# EAGLE design dip16breakout (EAGLE 8.6.0)
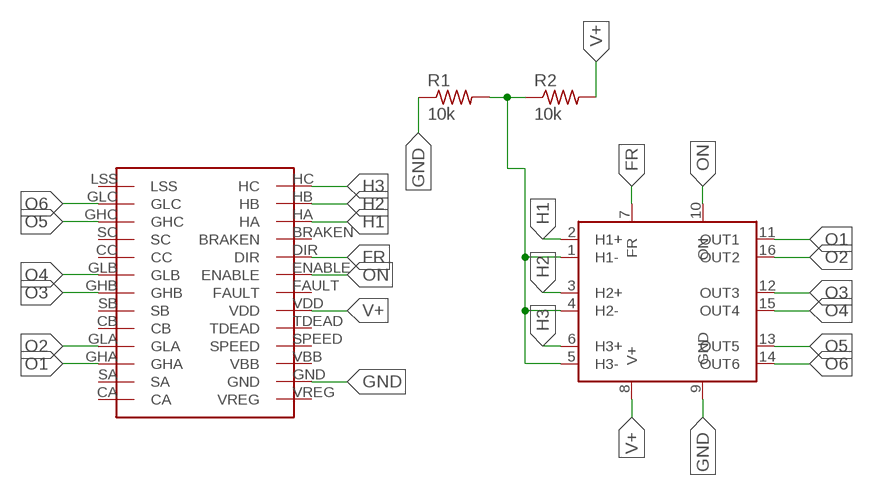
[diagram p0: schematic, sheet 1]

## Parts
R1  10k  R-US_R0805  [R0805]
R2  10k  R-US_R0805  [R0805]
U$1  NJM2624A  [DMP16]
U$2  TSSOP28-BRK  [TSSOP28-BRK]

## Nets
FR: U$1.7(FR) U$2.DIR
GND: R1.1 U$1.9(GND) U$2.GND
H1: U$1.2(H1+) U$2.HA
H2: U$1.3(H2+) U$2.HB
H3: U$1.6(H3+) U$2.HC
N$1: R1.2 R2.1 U$1.1(H1-) U$1.4(H2-) U$1.5(H3-)
O1: U$1.11(OUT1) U$2.GHA
O2: U$1.16(OUT2) U$2.GLA
O3: U$1.12(OUT3) U$2.GHB
O4: U$1.15(OUT4) U$2.GLB
O5: U$1.13(OUT5) U$2.GHC
O6: U$1.14(OUT6) U$2.GLC
ON: U$1.10(ON) U$2.ENABLE
V+: R2.2 U$1.8(V+) U$2.VDD
Unconnected: U$2.BRAKEN U$2.CA U$2.CB U$2.CC U$2.FAULT U$2.LSS U$2.SA U$2.SB U$2.SC U$2.SPEED U$2.TDEAD U$2.VBB U$2.VREG

## Library data of the parts
R1 R2 = resistor:R-US_: RESISTOR, American symbol
U$1 = NJM2624A:NJM2624A
U$2 = dedo:TSSOP28-BRK

## Board
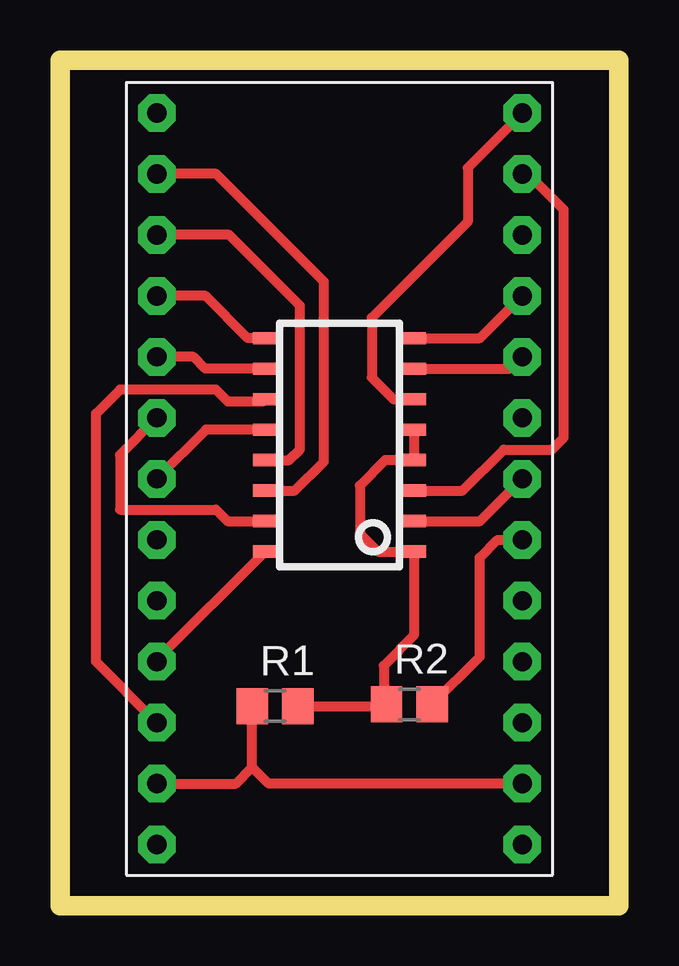
[diagram p1: board, top side]
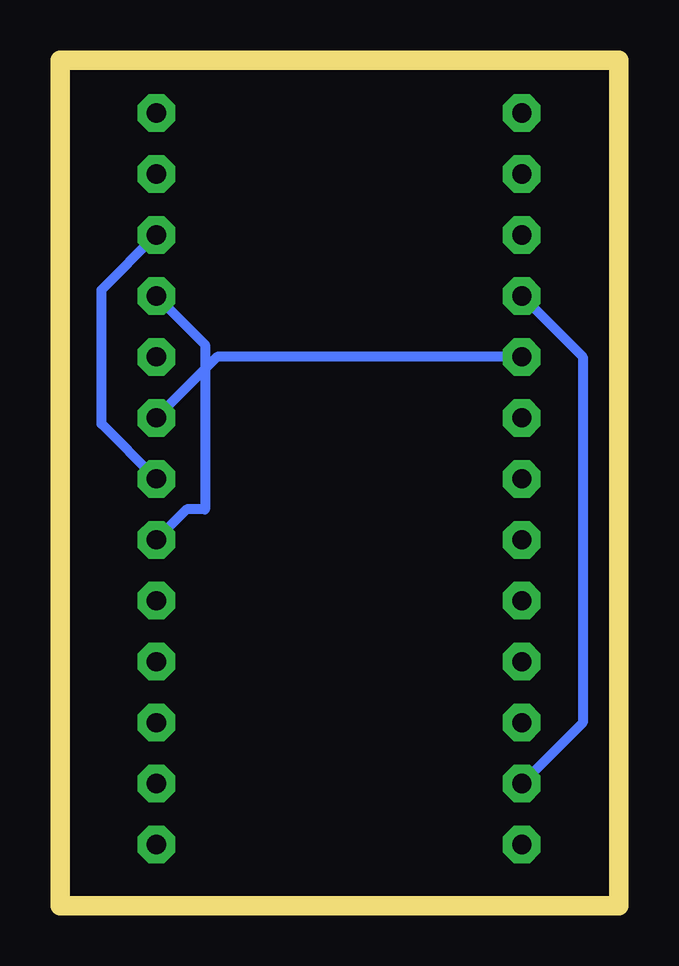
[diagram p2: board, bottom side, seen from below]

Size 23.3 x 35.23 mm. Coordinates in mm from the lower left corner, seen from the top.
Outline: 0,0 23.3,0 23.3,35.23 0,35.23 0,0
Copper layers (1*16): Top 0.035mm / dielectric 1.5mm / Bottom 0.035mm
Design rules "default *": minimum track width 6mil, minimum drill 0.35mm, track to track 6mil, track to pad 6mil, pad to pad 6mil, via to via 6mil, smd to smd 6mil, copper to edge 40mil, drill to drill 6mil, minimum pad ring 15mil, minimum via ring 8mil, stop-mask expansion 4mil, vias tented up to drill 0mil, thermal gap 10mil

### Footprints (pad centres in the part's own frame; a part is rotated, then mirrored left to right if it is on the bottom)
R0805 = smd 1.3 x 1.5: 1 -0.95,0; 2 0.95,0
DMP16 = smd 0.508 x 1.016: 1 -4.3,-3.1; 2 -3.03,-3.1; 3 -1.76,-3.1; 4 -0.49,-3.1; 5 0.78,-3.1; 6 2.05,-3.1; 7 3.32,-3.1; 8 4.59,-3.1; 9 4.59,3.1; 10 3.32,3.1; 11 2.05,3.1; 12 0.78,3.1; 13 -0.49,3.1; 14 -1.76,3.1; 15 -3.03,3.1; 16 -4.3,3.1
TSSOP28-BRK = drill 0.8 octagon: BRAKEN 7.62,8.89; CA -7.62,-13.97; CB -7.62,-3.81; CC -7.62,6.35; DIR 7.62,6.35; ENABLE 7.62,3.81; FAULT 7.62,1.27; GHA -7.62,-8.89; GHB -7.62,1.27; GHC -7.62,11.43; GLA -7.62,-6.35; GLB -7.62,3.81; GLC -7.62,13.97; GND 7.62,-11.43; HA 7.62,11.43; HB 7.62,13.97; HC 7.62,16.51; LSS -7.62,16.51; SA -7.62,-11.43; SB -7.62,-1.27; SC -7.62,8.89; SPEED 7.62,-6.35; TDEAD 7.62,-3.81; VBB 7.62,-8.89; VDD 7.62,-1.27; VREG 7.62,-13.97

### Placement (x,y rotation side)
R1  8.97,8.31 0 top
R2  14.57,8.38 0 top
U$1  11.66,19.05 90 top
U$2  11.66,16.51 0 top

### Tracks (layer width: path | path; a pad name or v marks a point on that pad's centre or on a via)
FR
  Top 0.406: U$1.7 18.79,22.37 U$2.DIR
GND  (via drill 0.8 pad 1.3)
  Top 0.406: U$1.9 7.83,23.64 6.07,25.4 v4.04,25.4 | v4.04,5.08 7.34,5.08 8.02,5.76 | 8.02,5.76 R1.1 | U$2.GND 8.7,5.08 8.02,5.76
  Bottom 0.406: v4.04,25.4 1.5,22.86 1.5,7.62 v4.04,5.08
H1  (via drill 0.8 pad 1.3)
  Top 0.406: U$1.2 17.52,16.02 v19.28,17.78
  Bottom 0.406: v19.28,17.78 21.57,20.07 21.57,25.65 U$2.HA
  other vias: 19.28,27.94
H2
  Top 0.406: U$1.3 16.79,17.29 18.5,19 20.5,19 21,19.5 21,29 19.52,30.48 U$2.HB
H3
  Top 0.406: U$2.HC 17,30.74 17,28.5 13,24.5 13,22 13.9,21.1 U$1.6
N$1
  Top 0.406: U$1.5 U$1.4 13.56,18.56 12.5,17.5 12.5,15.5 13.25,14.75 U$1.1 14.76,11.26 13.5,10 13.5,8.5 R2.1 13.55,8.31 R1.2
O1
  Top 0.406: U$2.GHA 1.5,10.16 1.5,20.5 2.5,21.5 6.5,21.5 7,21 8.46,21 U$1.11
O2
  Top 0.406: U$1.16 4.04,10.23 U$2.GLA
O3
  Top 0.406: U$1.12 6.09,19.83 U$2.GHB
O4
  Top 0.406: U$2.GLB 2.5,18.78 2.5,16.5 6.5,16.5 6.98,16.02 U$1.15
O5
  Top 0.406: U$1.13 9.56,18.56 10,19 10,25 7.06,27.94 U$2.GHC
O6
  Top 0.406: U$1.14 9.79,17.29 11,18.5 11,26 6.52,30.48 U$2.GLC
ON  (via drill 0.8 pad 1.3)
  Top 0.406: U$1.10 6.05,22.37 5.56,22.86 v4.04,22.86
  Bottom 0.406: v4.04,22.86 16.74,22.86 U$2.ENABLE
  other vias: 19.28,20.32
V+  (via drill 0.8 pad 1.3)
  Top 0.406: R2.2 17.5,10.36 17.5,14.5 18.24,15.24 U$2.VDD | U$1.8 17.52,23.64 v19.28,25.4
  Bottom 0.406: v19.28,25.4 17.25,23.37 17.25,16.51 18.01,16.51 U$2.VDD
  other vias: 19.28,15.24